# Altium project 8x8.PrjPcb
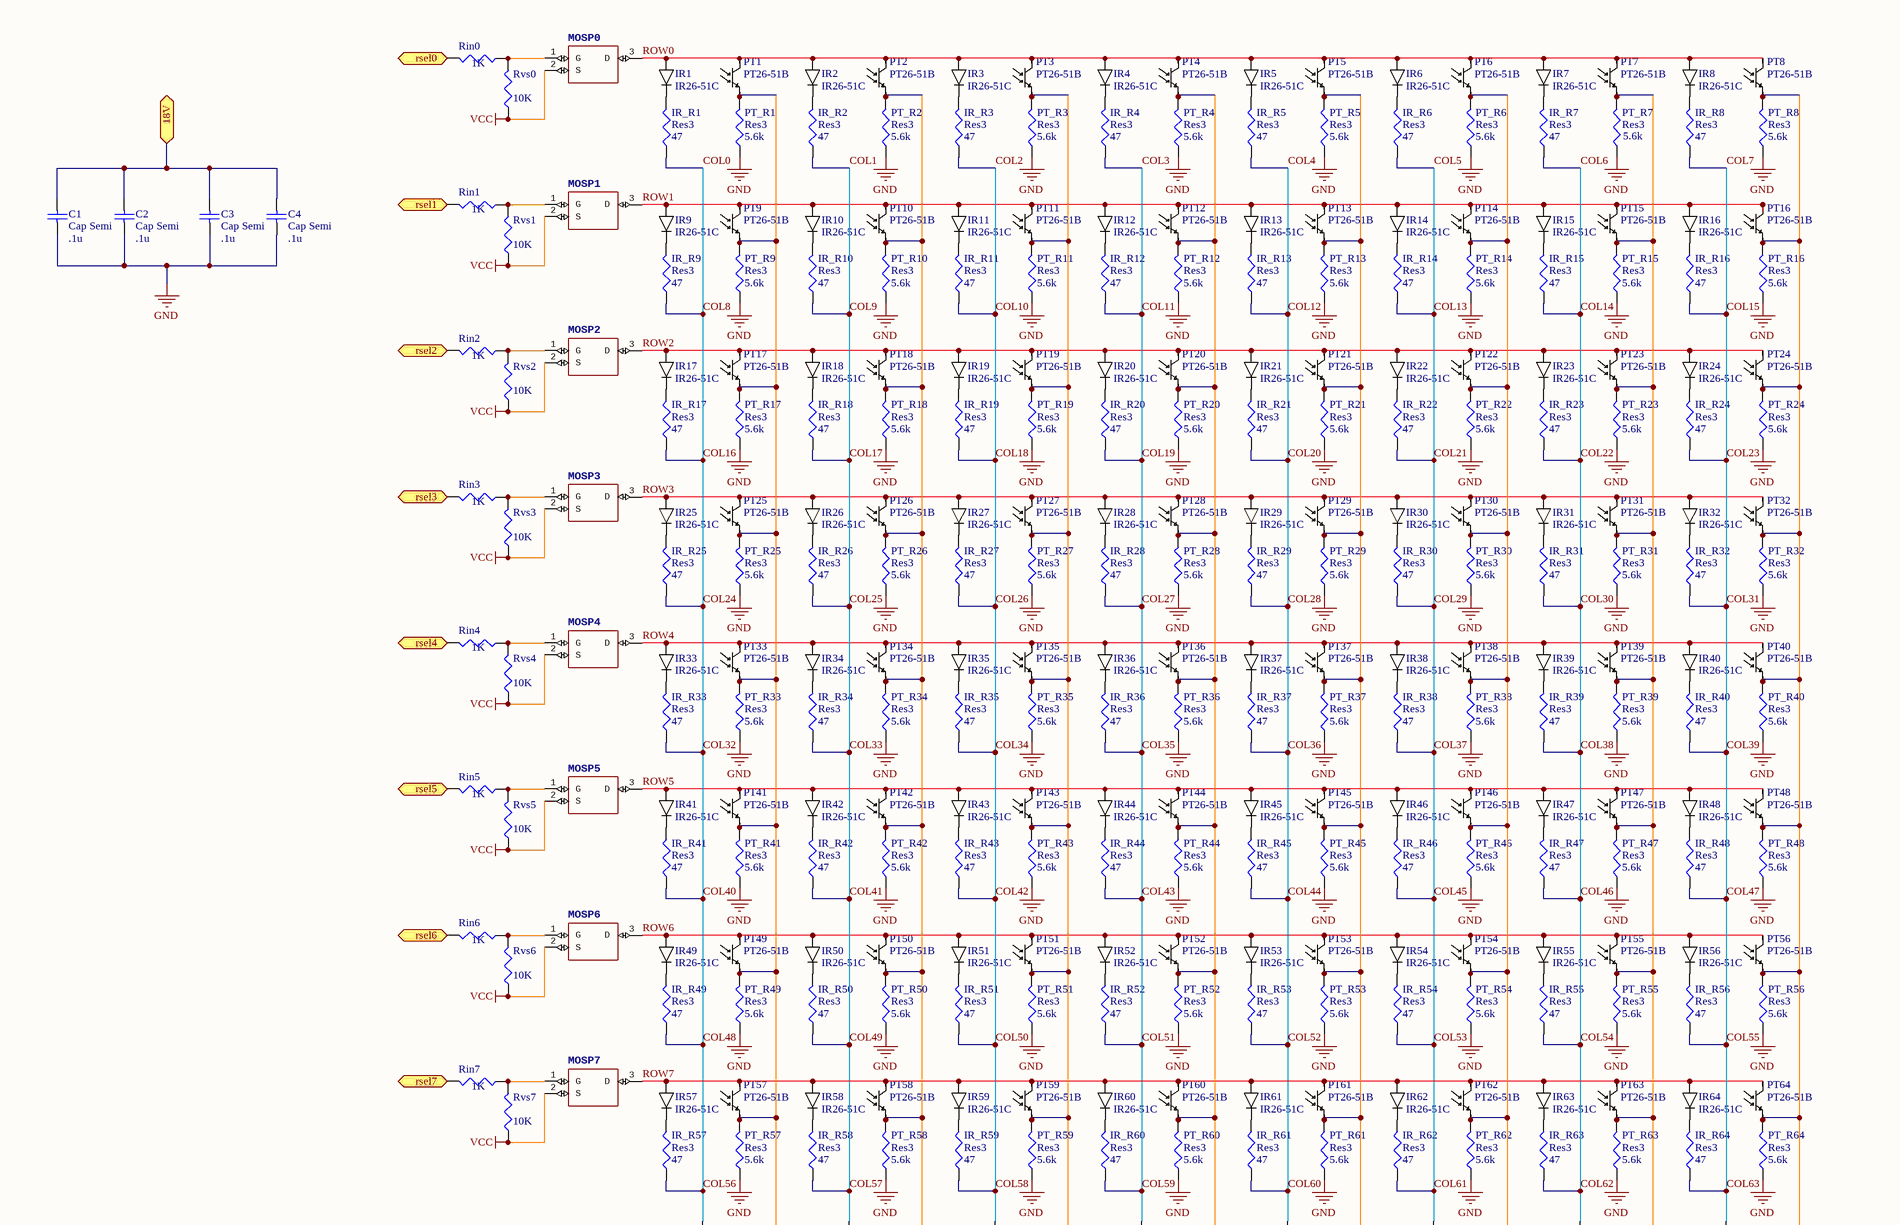
[diagram p0: 8x8v2.SchDoc, top left]
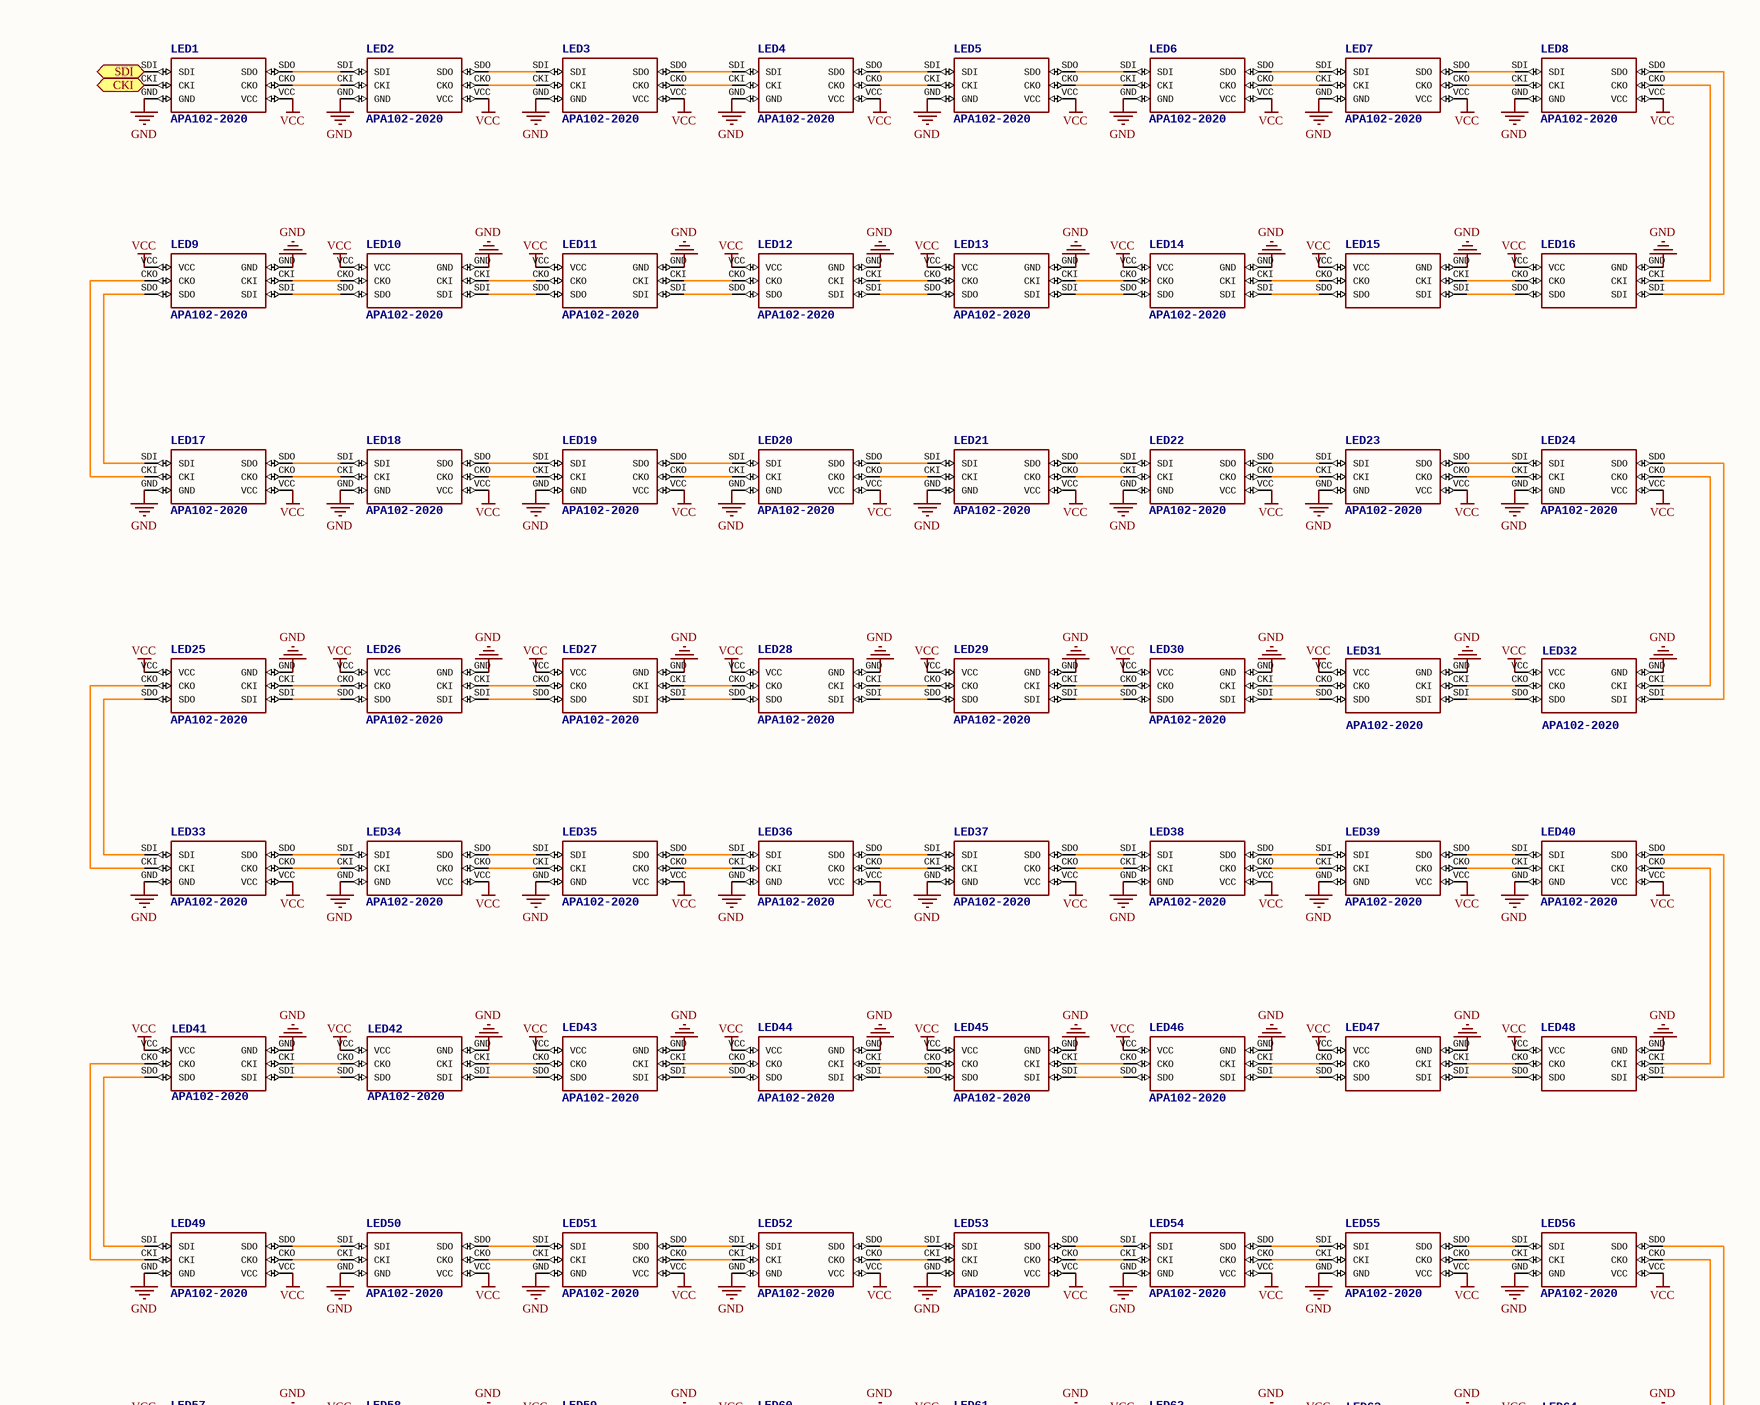
[diagram p1: 8x8v2.SchDoc, top right]
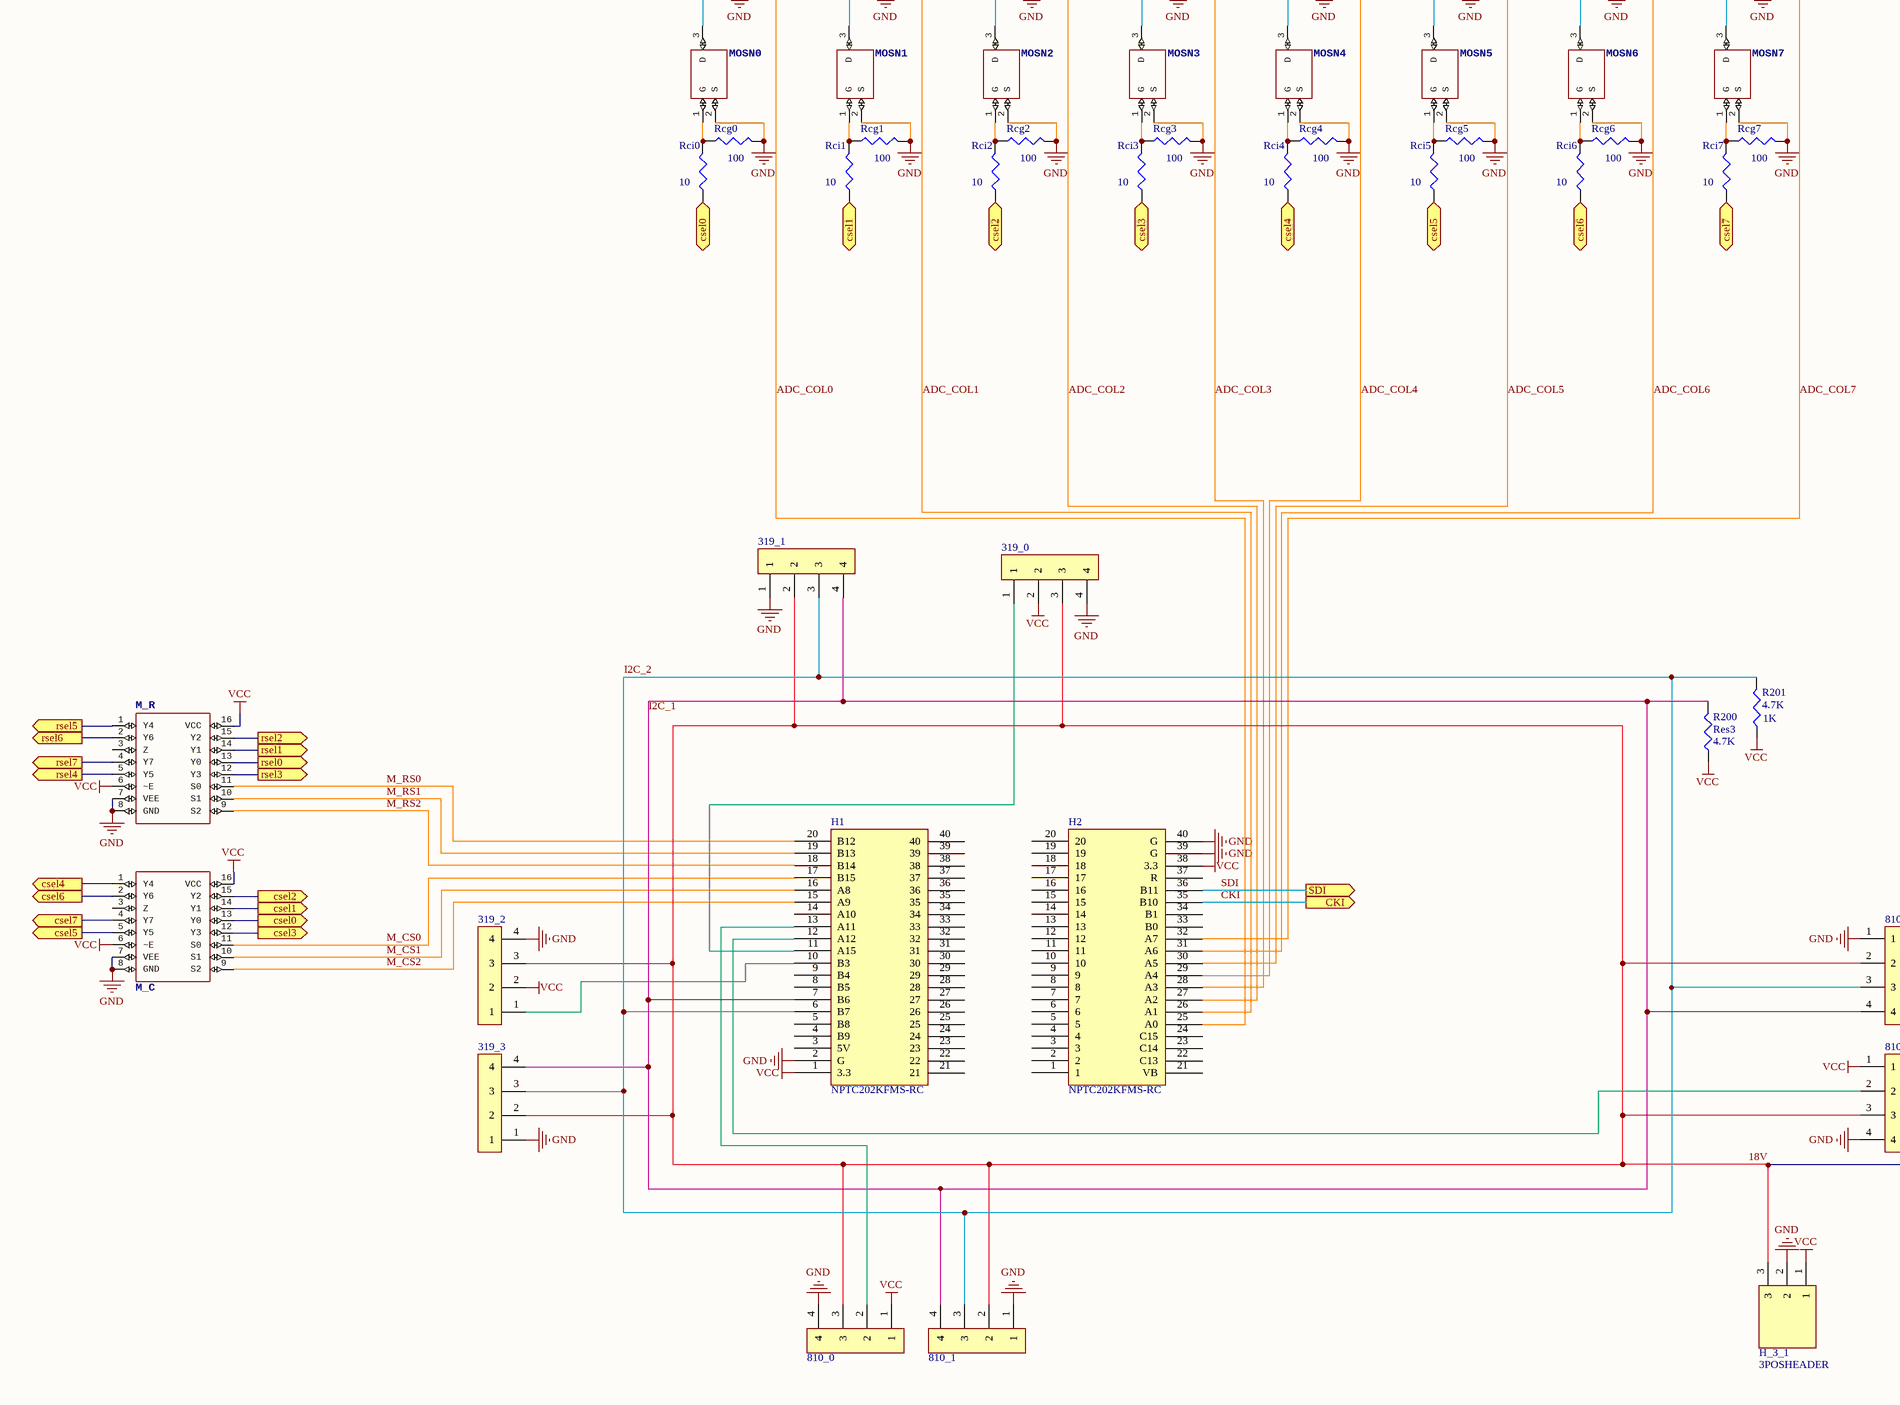
[diagram p2: 8x8v2.SchDoc, bottom left]
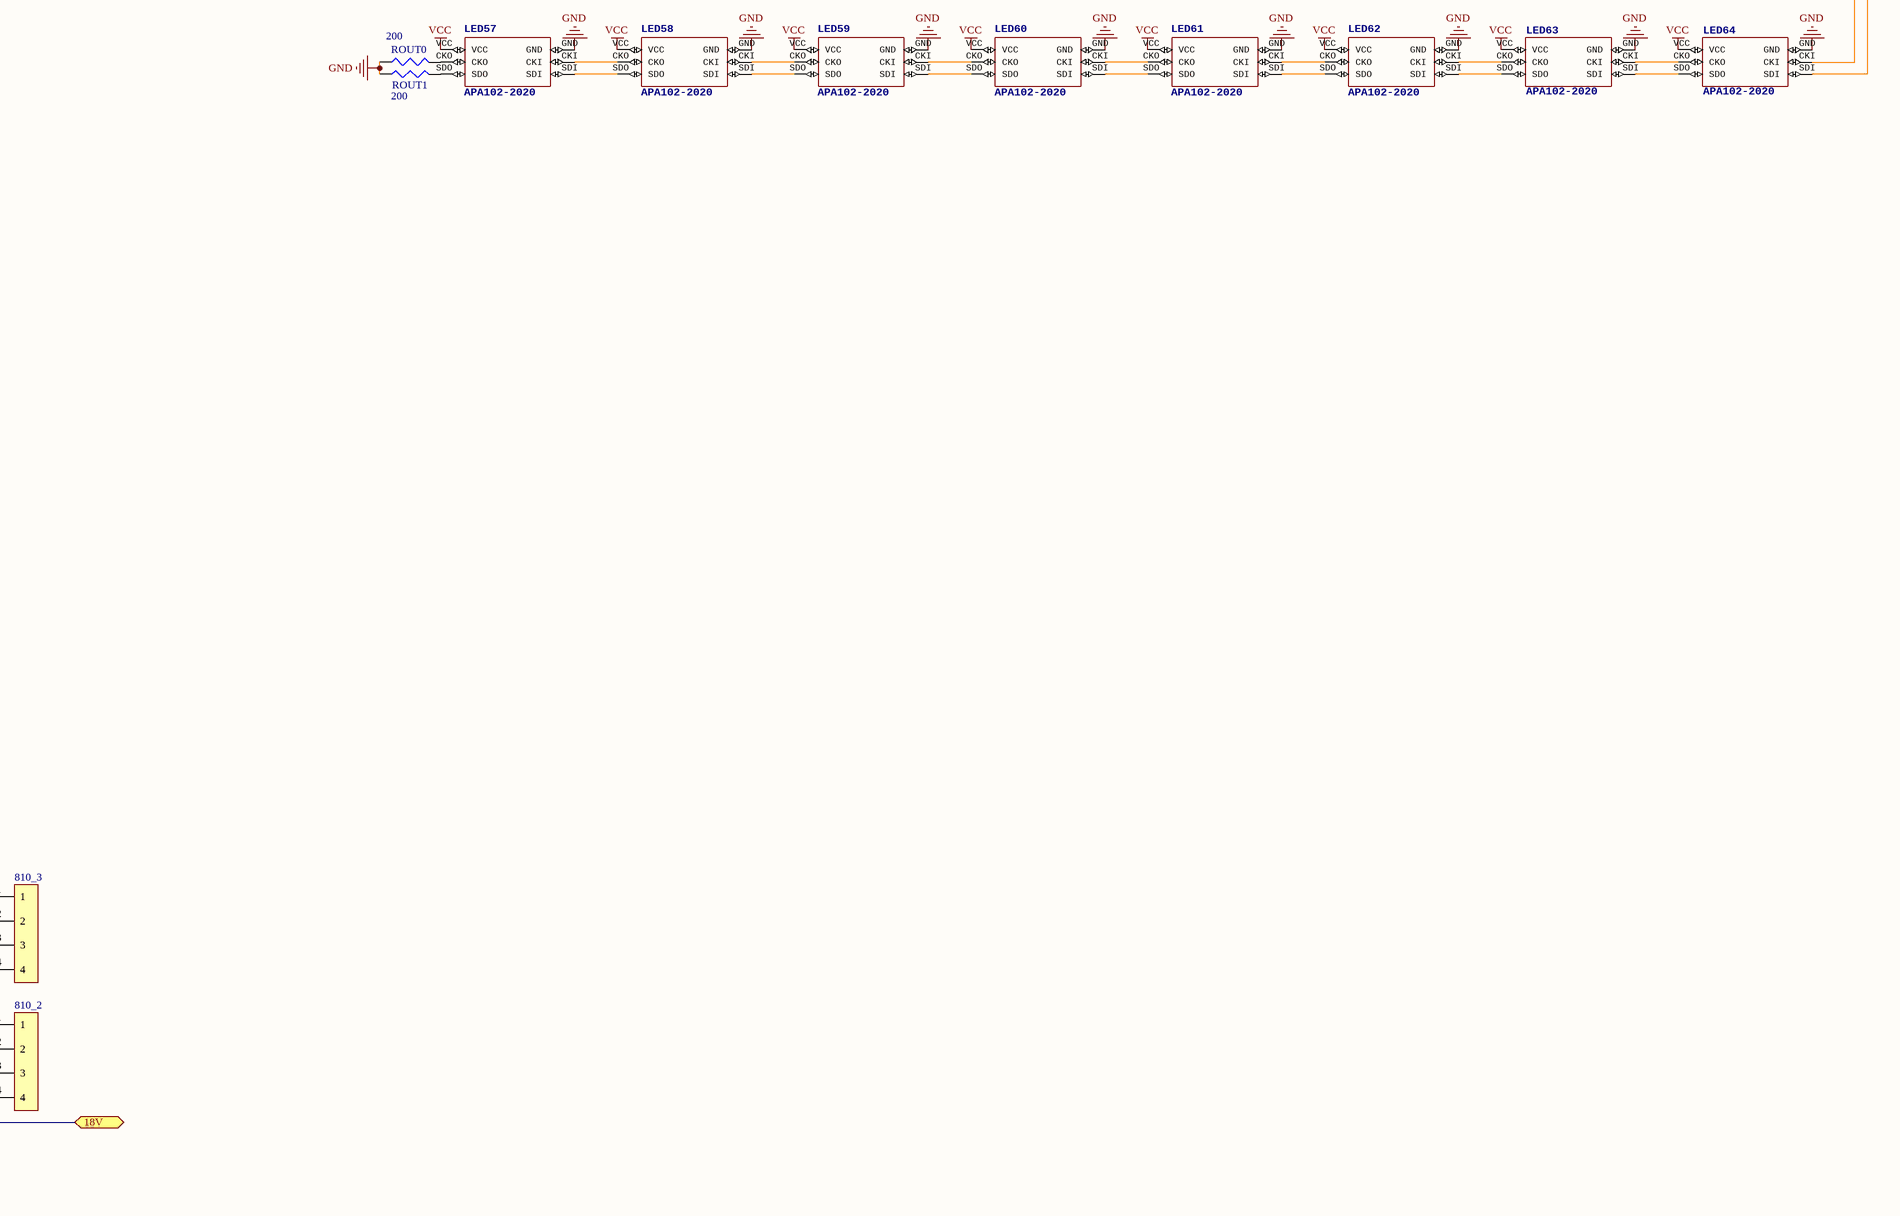
[diagram p3: 8x8v2.SchDoc, bottom right]
1 sheet, 389 parts. Net scope: flat (ports and power ports of the same name join across sheets).
Board file: 8x8v2.PcbDoc

## Sheet 8x8v2.SchDoc
size A1

### Parts
319_0  319_4  [319_4]  (value not drawn)
319_1  319_4  [319_4]  (value not drawn)
319_2  319_4  [319_4]  (value not drawn)
319_3  319_4  [319_4]  (value not drawn)
810_0  810_4  [810_4]  (value not drawn)
810_1  810_4  [810_4]  (value not drawn)
810_2  810_4  [810_4]  (value not drawn)
810_3  810_4  [810_4]  (value not drawn)
C1  Cap Semi  value .1u  [0402]
C2  Cap Semi  value .1u  [0402]
C3  Cap Semi  value .1u  [0402]
C4  Cap Semi  value .1u  [0402]
H1  NPTC202KFMS-RC  [NPTC202KFMS-RC]
H2  NPTC202KFMS-RC  [NPTC202KFMS-RC]
H_3_1  3POSHEADER  [3POSHEADER]
IR1  IR26-51C  [SFH 4056]
IR2  IR26-51C  [SFH 4056]
IR3  IR26-51C  [SFH 4056]
IR4  IR26-51C  [SFH 4056]
IR5  IR26-51C  [SFH 4056]
IR6  IR26-51C  [SFH 4056]
IR7  IR26-51C  [SFH 4056]
IR8  IR26-51C  [SFH 4056]
IR9  IR26-51C  [SFH 4056]
IR10  IR26-51C  [SFH 4056]
IR11  IR26-51C  [SFH 4056]
IR12  IR26-51C  [SFH 4056]
IR13  IR26-51C  [SFH 4056]
IR14  IR26-51C  [SFH 4056]
IR15  IR26-51C  [SFH 4056]
IR16  IR26-51C  [SFH 4056]
IR17  IR26-51C  [SFH 4056]
IR18  IR26-51C  [SFH 4056]
IR19  IR26-51C  [SFH 4056]
IR20  IR26-51C  [SFH 4056]
IR21  IR26-51C  [SFH 4056]
IR22  IR26-51C  [SFH 4056]
IR23  IR26-51C  [SFH 4056]
IR24  IR26-51C  [SFH 4056]
IR25  IR26-51C  [SFH 4056]
IR26  IR26-51C  [SFH 4056]
IR27  IR26-51C  [SFH 4056]
IR28  IR26-51C  [SFH 4056]
IR29  IR26-51C  [SFH 4056]
IR30  IR26-51C  [SFH 4056]
IR31  IR26-51C  [SFH 4056]
IR32  IR26-51C  [SFH 4056]
IR33  IR26-51C  [SFH 4056]
IR34  IR26-51C  [SFH 4056]
IR35  IR26-51C  [SFH 4056]
IR36  IR26-51C  [SFH 4056]
IR37  IR26-51C  [SFH 4056]
IR38  IR26-51C  [SFH 4056]
IR39  IR26-51C  [SFH 4056]
IR40  IR26-51C  [SFH 4056]
IR41  IR26-51C  [SFH 4056]
IR42  IR26-51C  [SFH 4056]
IR43  IR26-51C  [SFH 4056]
IR44  IR26-51C  [SFH 4056]
IR45  IR26-51C  [SFH 4056]
IR46  IR26-51C  [SFH 4056]
IR47  IR26-51C  [SFH 4056]
IR48  IR26-51C  [SFH 4056]
IR49  IR26-51C  [SFH 4056]
IR50  IR26-51C  [SFH 4056]
IR51  IR26-51C  [SFH 4056]
IR52  IR26-51C  [SFH 4056]
IR53  IR26-51C  [SFH 4056]
IR54  IR26-51C  [SFH 4056]
IR55  IR26-51C  [SFH 4056]
IR56  IR26-51C  [SFH 4056]
IR57  IR26-51C  [SFH 4056]
IR58  IR26-51C  [SFH 4056]
IR59  IR26-51C  [SFH 4056]
IR60  IR26-51C  [SFH 4056]
IR61  IR26-51C  [SFH 4056]
IR62  IR26-51C  [SFH 4056]
IR63  IR26-51C  [SFH 4056]
IR64  IR26-51C  [SFH 4056]
IR_R1  Res3  value 47  [J1-0603]
IR_R2  Res3  value 47  [J1-0603]
IR_R3  Res3  value 47  [J1-0603]
IR_R4  Res3  value 47  [J1-0603]
IR_R5  Res3  value 47  [J1-0603]
IR_R6  Res3  value 47  [J1-0603]
IR_R7  Res3  value 47  [J1-0603]
IR_R8  Res3  value 47  [J1-0603]
IR_R9  Res3  value 47  [J1-0603]
IR_R10  Res3  value 47  [J1-0603]
IR_R11  Res3  value 47  [J1-0603]
IR_R12  Res3  value 47  [J1-0603]
IR_R13  Res3  value 47  [J1-0603]
IR_R14  Res3  value 47  [J1-0603]
IR_R15  Res3  value 47  [J1-0603]
IR_R16  Res3  value 47  [J1-0603]
IR_R17  Res3  value 47  [J1-0603]
IR_R18  Res3  value 47  [J1-0603]
IR_R19  Res3  value 47  [J1-0603]
IR_R20  Res3  value 47  [J1-0603]
IR_R21  Res3  value 47  [J1-0603]
IR_R22  Res3  value 47  [J1-0603]
IR_R23  Res3  value 47  [J1-0603]
IR_R24  Res3  value 47  [J1-0603]
IR_R25  Res3  value 47  [J1-0603]
IR_R26  Res3  value 47  [J1-0603]
IR_R27  Res3  value 47  [J1-0603]
IR_R28  Res3  value 47  [J1-0603]
IR_R29  Res3  value 47  [J1-0603]
IR_R30  Res3  value 47  [J1-0603]
IR_R31  Res3  value 47  [J1-0603]
IR_R32  Res3  value 47  [J1-0603]
IR_R33  Res3  value 47  [J1-0603]
IR_R34  Res3  value 47  [J1-0603]
IR_R35  Res3  value 47  [J1-0603]
IR_R36  Res3  value 47  [J1-0603]
IR_R37  Res3  value 47  [J1-0603]
IR_R38  Res3  value 47  [J1-0603]
IR_R39  Res3  value 47  [J1-0603]
IR_R40  Res3  value 47  [J1-0603]
IR_R41  Res3  value 47  [J1-0603]
IR_R42  Res3  value 47  [J1-0603]
IR_R43  Res3  value 47  [J1-0603]
IR_R44  Res3  value 47  [J1-0603]
IR_R45  Res3  value 47  [J1-0603]
IR_R46  Res3  value 47  [J1-0603]
IR_R47  Res3  value 47  [J1-0603]
IR_R48  Res3  value 47  [J1-0603]
IR_R49  Res3  value 47  [J1-0603]
IR_R50  Res3  value 47  [J1-0603]
IR_R51  Res3  value 47  [J1-0603]
IR_R52  Res3  value 47  [J1-0603]
IR_R53  Res3  value 47  [J1-0603]
IR_R54  Res3  value 47  [J1-0603]
IR_R55  Res3  value 47  [J1-0603]
IR_R56  Res3  value 47  [J1-0603]
IR_R57  Res3  value 47  [J1-0603]
IR_R58  Res3  value 47  [J1-0603]
IR_R59  Res3  value 47  [J1-0603]
IR_R60  Res3  value 47  [J1-0603]
IR_R61  Res3  value 47  [J1-0603]
IR_R62  Res3  value 47  [J1-0603]
IR_R63  Res3  value 47  [J1-0603]
IR_R64  Res3  value 47  [J1-0603]
LED1  APA102-2020  [SON75P200X200X100-6N]
LED2  APA102-2020  [SON75P200X200X100-6N]
LED3  APA102-2020  [SON75P200X200X100-6N]
LED4  APA102-2020  [SON75P200X200X100-6N]
LED5  APA102-2020  [SON75P200X200X100-6N]
LED6  APA102-2020  [SON75P200X200X100-6N]
LED7  APA102-2020  [SON75P200X200X100-6N]
LED8  APA102-2020  [SON75P200X200X100-6N]
LED9  APA102-2020  [SON75P200X200X100-6N]
LED10  APA102-2020  [SON75P200X200X100-6N]
LED11  APA102-2020  [SON75P200X200X100-6N]
LED12  APA102-2020  [SON75P200X200X100-6N]
LED13  APA102-2020  [SON75P200X200X100-6N]
LED14  APA102-2020  [SON75P200X200X100-6N]
LED15  APA102-2020  [SON75P200X200X100-6N]  (value not drawn)
LED16  APA102-2020  [SON75P200X200X100-6N]  (value not drawn)
LED17  APA102-2020  [SON75P200X200X100-6N]
LED18  APA102-2020  [SON75P200X200X100-6N]
LED19  APA102-2020  [SON75P200X200X100-6N]
LED20  APA102-2020  [SON75P200X200X100-6N]
LED21  APA102-2020  [SON75P200X200X100-6N]
LED22  APA102-2020  [SON75P200X200X100-6N]
LED23  APA102-2020  [SON75P200X200X100-6N]
LED24  APA102-2020  [SON75P200X200X100-6N]
LED25  APA102-2020  [SON75P200X200X100-6N]
LED26  APA102-2020  [SON75P200X200X100-6N]
LED27  APA102-2020  [SON75P200X200X100-6N]
LED28  APA102-2020  [SON75P200X200X100-6N]
LED29  APA102-2020  [SON75P200X200X100-6N]
LED30  APA102-2020  [SON75P200X200X100-6N]
LED31  APA102-2020  [SON75P200X200X100-6N]
LED32  APA102-2020  [SON75P200X200X100-6N]
LED33  APA102-2020  [SON75P200X200X100-6N]
LED34  APA102-2020  [SON75P200X200X100-6N]
LED35  APA102-2020  [SON75P200X200X100-6N]
LED36  APA102-2020  [SON75P200X200X100-6N]
LED37  APA102-2020  [SON75P200X200X100-6N]
LED38  APA102-2020  [SON75P200X200X100-6N]
LED39  APA102-2020  [SON75P200X200X100-6N]
LED40  APA102-2020  [SON75P200X200X100-6N]
LED41  APA102-2020  [SON75P200X200X100-6N]
LED42  APA102-2020  [SON75P200X200X100-6N]
LED43  APA102-2020  [SON75P200X200X100-6N]
LED44  APA102-2020  [SON75P200X200X100-6N]
LED45  APA102-2020  [SON75P200X200X100-6N]
LED46  APA102-2020  [SON75P200X200X100-6N]
LED47  APA102-2020  [SON75P200X200X100-6N]  (value not drawn)
LED48  APA102-2020  [SON75P200X200X100-6N]  (value not drawn)
LED49  APA102-2020  [SON75P200X200X100-6N]
LED50  APA102-2020  [SON75P200X200X100-6N]
LED51  APA102-2020  [SON75P200X200X100-6N]
LED52  APA102-2020  [SON75P200X200X100-6N]
LED53  APA102-2020  [SON75P200X200X100-6N]
LED54  APA102-2020  [SON75P200X200X100-6N]
LED55  APA102-2020  [SON75P200X200X100-6N]
LED56  APA102-2020  [SON75P200X200X100-6N]
LED57  APA102-2020  [SON75P200X200X100-6N]
LED58  APA102-2020  [SON75P200X200X100-6N]
LED59  APA102-2020  [SON75P200X200X100-6N]
LED60  APA102-2020  [SON75P200X200X100-6N]
LED61  APA102-2020  [SON75P200X200X100-6N]
LED62  APA102-2020  [SON75P200X200X100-6N]
LED63  APA102-2020  [SON75P200X200X100-6N]
LED64  APA102-2020  [SON75P200X200X100-6N]
M_C  8-channel analog multiplexer/demultiplexer   Source:  Datasheet  [SOP65P640X110-16N]  (value not drawn)
M_R  8-channel analog multiplexer/demultiplexer   Source:  Datasheet  [SOP65P640X110-16N]  (value not drawn)
MOSN0  MOSFET 12V N-Ch Enh FET 2426pF 27.3nC   Source:  Datasheet  [SOT95P285X130-3N]  (value not drawn)
MOSN1  MOSFET 12V N-Ch Enh FET 2426pF 27.3nC   Source:  Datasheet  [SOT95P285X130-3N]  (value not drawn)
MOSN2  MOSFET 12V N-Ch Enh FET 2426pF 27.3nC   Source:  Datasheet  [SOT95P285X130-3N]  (value not drawn)
MOSN3  MOSFET 12V N-Ch Enh FET 2426pF 27.3nC   Source:  Datasheet  [SOT95P285X130-3N]  (value not drawn)
MOSN4  MOSFET 12V N-Ch Enh FET 2426pF 27.3nC   Source:  Datasheet  [SOT95P285X130-3N]  (value not drawn)
MOSN5  MOSFET 12V N-Ch Enh FET 2426pF 27.3nC   Source:  Datasheet  [SOT95P285X130-3N]  (value not drawn)
MOSN6  MOSFET 12V N-Ch Enh FET 2426pF 27.3nC   Source:  Datasheet  [SOT95P285X130-3N]  (value not drawn)
MOSN7  MOSFET 12V N-Ch Enh FET 2426pF 27.3nC   Source:  Datasheet  [SOT95P285X130-3N]  (value not drawn)
MOSP0  Power MOSFET   Source:  Datasheet  [SOT65P220X100-3N]  (value not drawn)
MOSP1  Power MOSFET   Source:  Datasheet  [SOT65P220X100-3N]  (value not drawn)
MOSP2  Power MOSFET   Source:  Datasheet  [SOT65P220X100-3N]  (value not drawn)
MOSP3  Power MOSFET   Source:  Datasheet  [SOT65P220X100-3N]  (value not drawn)
MOSP4  Power MOSFET   Source:  Datasheet  [SOT65P220X100-3N]  (value not drawn)
MOSP5  Power MOSFET   Source:  Datasheet  [SOT65P220X100-3N]  (value not drawn)
MOSP6  Power MOSFET   Source:  Datasheet  [SOT65P220X100-3N]  (value not drawn)
MOSP7  Power MOSFET   Source:  Datasheet  [SOT65P220X100-3N]  (value not drawn)
PT1  PT26-51B  [VEMT2020X01]
PT2  PT26-51B  [VEMT2020X01]
PT3  PT26-51B  [VEMT2020X01]
PT4  PT26-51B  [VEMT2020X01]
PT5  PT26-51B  [VEMT2020X01]
PT6  PT26-51B  [VEMT2020X01]
PT7  PT26-51B  [VEMT2020X01]
PT8  PT26-51B  [VEMT2020X01]
PT9  PT26-51B  [VEMT2020X01]
PT10  PT26-51B  [VEMT2020X01]
PT11  PT26-51B  [VEMT2020X01]
PT12  PT26-51B  [VEMT2020X01]
PT13  PT26-51B  [VEMT2020X01]
PT14  PT26-51B  [VEMT2020X01]
PT15  PT26-51B  [VEMT2020X01]
PT16  PT26-51B  [VEMT2020X01]
PT17  PT26-51B  [VEMT2020X01]
PT18  PT26-51B  [VEMT2020X01]
PT19  PT26-51B  [VEMT2020X01]
PT20  PT26-51B  [VEMT2020X01]
PT21  PT26-51B  [VEMT2020X01]
PT22  PT26-51B  [VEMT2020X01]
PT23  PT26-51B  [VEMT2020X01]
PT24  PT26-51B  [VEMT2020X01]
PT25  PT26-51B  [VEMT2020X01]
PT26  PT26-51B  [VEMT2020X01]
PT27  PT26-51B  [VEMT2020X01]
PT28  PT26-51B  [VEMT2020X01]
PT29  PT26-51B  [VEMT2020X01]
PT30  PT26-51B  [VEMT2020X01]
PT31  PT26-51B  [VEMT2020X01]
PT32  PT26-51B  [VEMT2020X01]
PT33  PT26-51B  [VEMT2020X01]
PT34  PT26-51B  [VEMT2020X01]
PT35  PT26-51B  [VEMT2020X01]
PT36  PT26-51B  [VEMT2020X01]
PT37  PT26-51B  [VEMT2020X01]
PT38  PT26-51B  [VEMT2020X01]
PT39  PT26-51B  [VEMT2020X01]
PT40  PT26-51B  [VEMT2020X01]
PT41  PT26-51B  [VEMT2020X01]
PT42  PT26-51B  [VEMT2020X01]
PT43  PT26-51B  [VEMT2020X01]
PT44  PT26-51B  [VEMT2020X01]
PT45  PT26-51B  [VEMT2020X01]
PT46  PT26-51B  [VEMT2020X01]
PT47  PT26-51B  [VEMT2020X01]
PT48  PT26-51B  [VEMT2020X01]
PT49  PT26-51B  [VEMT2020X01]
PT50  PT26-51B  [VEMT2020X01]
PT51  PT26-51B  [VEMT2020X01]
PT52  PT26-51B  [VEMT2020X01]
PT53  PT26-51B  [VEMT2020X01]
PT54  PT26-51B  [VEMT2020X01]
PT55  PT26-51B  [VEMT2020X01]
PT56  PT26-51B  [VEMT2020X01]
PT57  PT26-51B  [VEMT2020X01]
PT58  PT26-51B  [VEMT2020X01]
PT59  PT26-51B  [VEMT2020X01]
PT60  PT26-51B  [VEMT2020X01]
PT61  PT26-51B  [VEMT2020X01]
PT62  PT26-51B  [VEMT2020X01]
PT63  PT26-51B  [VEMT2020X01]
PT64  PT26-51B  [VEMT2020X01]
PT_R1  Res3  value 5.6k  [J1-0603]
PT_R2  Res3  value 5.6k  [J1-0603]
PT_R3  Res3  value 5.6k  [J1-0603]
PT_R4  Res3  value 5.6k  [J1-0603]
PT_R5  Res3  value 5.6k  [J1-0603]
PT_R6  Res3  value 5.6k  [J1-0603]
PT_R7  Res3  value 5.6k  [J1-0603]
PT_R8  Res3  value 5.6k  [J1-0603]
PT_R9  Res3  value 5.6k  [J1-0603]
PT_R10  Res3  value 5.6k  [J1-0603]
PT_R11  Res3  value 5.6k  [J1-0603]
PT_R12  Res3  value 5.6k  [J1-0603]
PT_R13  Res3  value 5.6k  [J1-0603]
PT_R14  Res3  value 5.6k  [J1-0603]
PT_R15  Res3  value 5.6k  [J1-0603]
PT_R16  Res3  value 5.6k  [J1-0603]
PT_R17  Res3  value 5.6k  [J1-0603]
PT_R18  Res3  value 5.6k  [J1-0603]
PT_R19  Res3  value 5.6k  [J1-0603]
PT_R20  Res3  value 5.6k  [J1-0603]
PT_R21  Res3  value 5.6k  [J1-0603]
PT_R22  Res3  value 5.6k  [J1-0603]
PT_R23  Res3  value 5.6k  [J1-0603]
PT_R24  Res3  value 5.6k  [J1-0603]
PT_R25  Res3  value 5.6k  [J1-0603]
PT_R26  Res3  value 5.6k  [J1-0603]
PT_R27  Res3  value 5.6k  [J1-0603]
PT_R28  Res3  value 5.6k  [J1-0603]
PT_R29  Res3  value 5.6k  [J1-0603]
PT_R30  Res3  value 5.6k  [J1-0603]
PT_R31  Res3  value 5.6k  [J1-0603]
PT_R32  Res3  value 5.6k  [J1-0603]
PT_R33  Res3  value 5.6k  [J1-0603]
PT_R34  Res3  value 5.6k  [J1-0603]
PT_R35  Res3  value 5.6k  [J1-0603]
PT_R36  Res3  value 5.6k  [J1-0603]
PT_R37  Res3  value 5.6k  [J1-0603]
PT_R38  Res3  value 5.6k  [J1-0603]
PT_R39  Res3  value 5.6k  [J1-0603]
PT_R40  Res3  value 5.6k  [J1-0603]
PT_R41  Res3  value 5.6k  [J1-0603]
PT_R42  Res3  value 5.6k  [J1-0603]
PT_R43  Res3  value 5.6k  [J1-0603]
PT_R44  Res3  value 5.6k  [J1-0603]
PT_R45  Res3  value 5.6k  [J1-0603]
PT_R46  Res3  value 5.6k  [J1-0603]
PT_R47  Res3  value 5.6k  [J1-0603]
PT_R48  Res3  value 5.6k  [J1-0603]
PT_R49  Res3  value 5.6k  [J1-0603]
PT_R50  Res3  value 5.6k  [J1-0603]
PT_R51  Res3  value 5.6k  [J1-0603]
PT_R52  Res3  value 5.6k  [J1-0603]
PT_R53  Res3  value 5.6k  [J1-0603]
PT_R54  Res3  value 5.6k  [J1-0603]
PT_R55  Res3  value 5.6k  [J1-0603]
PT_R56  Res3  value 5.6k  [J1-0603]
PT_R57  Res3  value 5.6k  [J1-0603]
PT_R58  Res3  value 5.6k  [J1-0603]
PT_R59  Res3  value 5.6k  [J1-0603]
PT_R60  Res3  value 5.6k  [J1-0603]
PT_R61  Res3  value 5.6k  [J1-0603]
PT_R62  Res3  value 5.6k  [J1-0603]
PT_R63  Res3  value 5.6k  [J1-0603]
PT_R64  Res3  value 5.6k  [J1-0603]
R200  Res3  value 4.7K  [J1-0603]
R201  4.7K  value 1K  [J1-0603]
Rcg0  value 100  [J1-0603]  (hidden comment: Res3)
Rcg1  value 100  [J1-0603]  (hidden comment: Res3)
Rcg2  value 100  [J1-0603]  (hidden comment: Res3)
Rcg3  value 100  [J1-0603]  (hidden comment: Res3)
Rcg4  value 100  [J1-0603]  (hidden comment: Res3)
Rcg5  value 100  [J1-0603]  (hidden comment: Res3)
Rcg6  value 100  [J1-0603]  (hidden comment: Res3)
Rcg7  value 100  [J1-0603]  (hidden comment: Res3)
Rci0  value 10  [J1-0603]  (hidden comment: Res3)
Rci1  value 10  [J1-0603]  (hidden comment: Res3)
Rci2  value 10  [J1-0603]  (hidden comment: Res3)
Rci3  value 10  [J1-0603]  (hidden comment: Res3)
Rci4  value 10  [J1-0603]  (hidden comment: Res3)
Rci5  value 10  [J1-0603]  (hidden comment: Res3)
Rci6  value 10  [J1-0603]  (hidden comment: Res3)
Rci7  value 10  [J1-0603]  (hidden comment: Res3)
Rin0  value 1K  [J1-0603]  (hidden comment: Res3)
Rin1  value 1K  [J1-0603]  (hidden comment: Res3)
Rin2  value 1K  [J1-0603]  (hidden comment: Res3)
Rin3  value 1K  [J1-0603]  (hidden comment: Res3)
Rin4  value 1K  [J1-0603]  (hidden comment: Res3)
Rin5  value 1K  [J1-0603]  (hidden comment: Res3)
Rin6  value 1K  [J1-0603]  (hidden comment: Res3)
Rin7  value 1K  [J1-0603]  (hidden comment: Res3)
ROUT0  value 200  [J1-0603]  (hidden comment: Res3)
ROUT1  value 200  [J1-0603]  (hidden comment: Res3)
Rvs0  value 10K  [J1-0603]  (hidden comment: Res3)
Rvs1  value 10K  [J1-0603]  (hidden comment: Res3)
Rvs2  value 10K  [J1-0603]  (hidden comment: Res3)
Rvs3  value 10K  [J1-0603]  (hidden comment: Res3)
Rvs4  value 10K  [J1-0603]  (hidden comment: Res3)
Rvs5  value 10K  [J1-0603]  (hidden comment: Res3)
Rvs6  value 10K  [J1-0603]  (hidden comment: Res3)
Rvs7  value 10K  [J1-0603]  (hidden comment: Res3)

### Ports
18V (bidir), CKI (in), CKI (out), csel0 (in), csel0 (out), csel1 (in), csel1 (out), csel2 (in), csel2 (out), csel3 (in), csel3 (out), csel4 (in), csel4 (out), csel5 (in), csel5 (out), csel6 (in), csel6 (out), csel7 (in), csel7 (out), rsel0 (in), rsel0 (out), rsel1 (in), rsel1 (out), rsel2 (in), rsel2 (out), rsel3 (in), rsel3 (out), rsel4 (in), rsel4 (out), rsel5 (in), rsel5 (out), rsel6 (in), rsel6 (out), rsel7 (in), rsel7 (out), SDI (in), SDI (out)

### Nets
GND: 319_0.4 319_1.1 319_2.4 319_3.1 810_0.4 810_1.1 810_2.4 810_3.1 C1.1 C2.1 C3.1 C4.1 H1.2(G) H2.39(G) H2.40(G) H_3_1.2 LED1.GND LED2.GND LED3.GND LED4.GND LED5.GND LED6.GND LED7.GND LED8.GND LED9.GND LED10.GND LED11.GND LED12.GND LED13.GND LED14.GND LED15.GND LED16.GND LED17.GND LED18.GND LED19.GND LED20.GND LED21.GND LED22.GND LED23.GND LED24.GND LED25.GND LED26.GND LED27.GND LED28.GND LED29.GND LED30.GND LED31.GND LED32.GND LED33.GND LED34.GND LED35.GND LED36.GND LED37.GND LED38.GND LED39.GND LED40.GND LED41.GND LED42.GND LED43.GND LED44.GND LED45.GND LED46.GND LED47.GND LED48.GND LED49.GND LED50.GND LED51.GND LED52.GND LED53.GND LED54.GND LED55.GND LED56.GND LED57.GND LED58.GND LED59.GND LED60.GND LED61.GND LED62.GND LED63.GND LED64.GND M_C.7(VEE) M_C.8(GND) M_R.7(VEE) M_R.8(GND) MOSN0.2(S) MOSN1.2(S) MOSN2.2(S) MOSN3.2(S) MOSN4.2(S) MOSN5.2(S) MOSN6.2(S) MOSN7.2(S) PT_R1.1 PT_R2.1 PT_R3.1 PT_R4.1 PT_R5.1 PT_R6.1 PT_R7.1 PT_R8.1 PT_R9.1 PT_R10.1 PT_R11.1 PT_R12.1 PT_R13.1 PT_R14.1 PT_R15.1 PT_R16.1 PT_R17.1 PT_R18.1 PT_R19.1 PT_R20.1 PT_R21.1 PT_R22.1 PT_R23.1 PT_R24.1 PT_R25.1 PT_R26.1 PT_R27.1 PT_R28.1 PT_R29.1 PT_R30.1 PT_R31.1 PT_R32.1 PT_R33.1 PT_R34.1 PT_R35.1 PT_R36.1 PT_R37.1 PT_R38.1 PT_R39.1 PT_R40.1 PT_R41.1 PT_R42.1 PT_R43.1 PT_R44.1 PT_R45.1 PT_R46.1 PT_R47.1 PT_R48.1 PT_R49.1 PT_R50.1 PT_R51.1 PT_R52.1 PT_R53.1 PT_R54.1 PT_R55.1 PT_R56.1 PT_R57.1 PT_R58.1 PT_R59.1 PT_R60.1 PT_R61.1 PT_R62.1 PT_R63.1 PT_R64.1 Rcg0.2 Rcg1.2 Rcg2.2 Rcg3.2 Rcg4.2 Rcg5.2 Rcg6.2 Rcg7.2 ROUT0.1 ROUT1.1
VCC: 319_0.2 319_2.2 810_0.1 810_2.1 H1.1(3.3) H2.38(3.3) H_3_1.1 LED1.VCC LED2.VCC LED3.VCC LED4.VCC LED5.VCC LED6.VCC LED7.VCC LED8.VCC LED9.VCC LED10.VCC LED11.VCC LED12.VCC LED13.VCC LED14.VCC LED15.VCC LED16.VCC LED17.VCC LED18.VCC LED19.VCC LED20.VCC LED21.VCC LED22.VCC LED23.VCC LED24.VCC LED25.VCC LED26.VCC LED27.VCC LED28.VCC LED29.VCC LED30.VCC LED31.VCC LED32.VCC LED33.VCC LED34.VCC LED35.VCC LED36.VCC LED37.VCC LED38.VCC LED39.VCC LED40.VCC LED41.VCC LED42.VCC LED43.VCC LED44.VCC LED45.VCC LED46.VCC LED47.VCC LED48.VCC LED49.VCC LED50.VCC LED51.VCC LED52.VCC LED53.VCC LED54.VCC LED55.VCC LED56.VCC LED57.VCC LED58.VCC LED59.VCC LED60.VCC LED61.VCC LED62.VCC LED63.VCC LED64.VCC M_C.6(~E) M_C.16(VCC) M_R.6(~E) M_R.16(VCC) MOSP0.2(S) MOSP1.2(S) MOSP2.2(S) MOSP3.2(S) MOSP4.2(S) MOSP5.2(S) MOSP6.2(S) MOSP7.2(S) R200.1 R201.1 Rvs0.1 Rvs1.1 Rvs2.1 Rvs3.1 Rvs4.1 Rvs5.1 Rvs6.1 Rvs7.1
18V: 319_0.3 319_1.2 319_2.3 319_3.2 810_0.3 810_1.2 810_2.3 810_3.2 C1.2 C2.2 C3.2 C4.2 H_3_1.3 ; port 18V
ADC_COL0: H2.25(A0) PT1.2(E) PT9.2(E) PT17.2(E) PT25.2(E) PT33.2(E) PT41.2(E) PT49.2(E) PT57.2(E) PT_R1.2 PT_R9.2 PT_R17.2 PT_R25.2 PT_R33.2 PT_R41.2 PT_R49.2 PT_R57.2
ADC_COL1: H2.26(A1) PT2.2(E) PT10.2(E) PT18.2(E) PT26.2(E) PT34.2(E) PT42.2(E) PT50.2(E) PT58.2(E) PT_R2.2 PT_R10.2 PT_R18.2 PT_R26.2 PT_R34.2 PT_R42.2 PT_R50.2 PT_R58.2
ADC_COL2: H2.27(A2) PT3.2(E) PT11.2(E) PT19.2(E) PT27.2(E) PT35.2(E) PT43.2(E) PT51.2(E) PT59.2(E) PT_R3.2 PT_R11.2 PT_R19.2 PT_R27.2 PT_R35.2 PT_R43.2 PT_R51.2 PT_R59.2
ADC_COL3: H2.28(A3) PT4.2(E) PT12.2(E) PT20.2(E) PT28.2(E) PT36.2(E) PT44.2(E) PT52.2(E) PT60.2(E) PT_R4.2 PT_R12.2 PT_R20.2 PT_R28.2 PT_R36.2 PT_R44.2 PT_R52.2 PT_R60.2
ADC_COL4: H2.29(A4) PT5.2(E) PT13.2(E) PT21.2(E) PT29.2(E) PT37.2(E) PT45.2(E) PT53.2(E) PT61.2(E) PT_R5.2 PT_R13.2 PT_R21.2 PT_R29.2 PT_R37.2 PT_R45.2 PT_R53.2 PT_R61.2
ADC_COL5: H2.30(A5) PT6.2(E) PT14.2(E) PT22.2(E) PT30.2(E) PT38.2(E) PT46.2(E) PT54.2(E) PT62.2(E) PT_R6.2 PT_R14.2 PT_R22.2 PT_R30.2 PT_R38.2 PT_R46.2 PT_R54.2 PT_R62.2
ADC_COL6: H2.31(A6) PT7.2(E) PT15.2(E) PT23.2(E) PT31.2(E) PT39.2(E) PT47.2(E) PT55.2(E) PT63.2(E) PT_R7.2 PT_R15.2 PT_R23.2 PT_R31.2 PT_R39.2 PT_R47.2 PT_R55.2 PT_R63.2
ADC_COL7: H2.32(A7) PT8.2(E) PT16.2(E) PT24.2(E) PT32.2(E) PT40.2(E) PT48.2(E) PT56.2(E) PT64.2(E) PT_R8.2 PT_R16.2 PT_R24.2 PT_R32.2 PT_R40.2 PT_R48.2 PT_R56.2 PT_R64.2
CKI: H2.35(B10) LED1.CKI ; port CKI
COL0: IR_R1.1 IR_R9.1 IR_R17.1 IR_R25.1 IR_R33.1 IR_R41.1 IR_R49.1 IR_R57.1 MOSN0.3(D)  [also labelled COL16, COL24, COL32, COL40, COL48, COL56, COL8]
COL1: IR_R2.1 IR_R10.1 IR_R18.1 IR_R26.1 IR_R34.1 IR_R42.1 IR_R50.1 IR_R58.1 MOSN1.3(D)  [also labelled COL17, COL25, COL33, COL41, COL49, COL57, COL9]
COL10: IR_R3.1 IR_R11.1 IR_R19.1 IR_R27.1 IR_R35.1 IR_R43.1 IR_R51.1 IR_R59.1 MOSN2.3(D)  [also labelled COL18, COL2, COL26, COL34, COL42, COL50, COL58]
COL11: IR_R4.1 IR_R12.1 IR_R20.1 IR_R28.1 IR_R36.1 IR_R44.1 IR_R52.1 IR_R60.1 MOSN3.3(D)  [also labelled COL19, COL27, COL3, COL35, COL43, COL51, COL59]
COL12: IR_R5.1 IR_R13.1 IR_R21.1 IR_R29.1 IR_R37.1 IR_R45.1 IR_R53.1 IR_R61.1 MOSN4.3(D)  [also labelled COL20, COL28, COL36, COL4, COL44, COL52, COL60]
COL13: IR_R6.1 IR_R14.1 IR_R22.1 IR_R30.1 IR_R38.1 IR_R46.1 IR_R54.1 IR_R62.1 MOSN5.3(D)  [also labelled COL21, COL29, COL37, COL45, COL5, COL53, COL61]
COL14: IR_R7.1 IR_R15.1 IR_R23.1 IR_R31.1 IR_R39.1 IR_R47.1 IR_R55.1 IR_R63.1 MOSN6.3(D)  [also labelled COL22, COL30, COL38, COL46, COL54, COL6, COL62]
COL15: IR_R8.1 IR_R16.1 IR_R24.1 IR_R32.1 IR_R40.1 IR_R48.1 IR_R56.1 IR_R64.1 MOSN7.3(D)  [also labelled COL23, COL31, COL39, COL47, COL55, COL63, COL7]
I2C_1: 319_1.4 319_3.4 810_1.4 810_3.4 H1.7(B6) R200.2
I2C_2: 319_1.3 319_3.3 810_1.3 810_3.3 H1.6(B7) R201.2
M_CS0: H1.17(B15) M_C.11(S0)
M_CS1: H1.16(A8) M_C.10(S1)
M_CS2: H1.15(A9) M_C.9(S2)
M_RS0: H1.20(B12) M_R.11(S0)
M_RS1: H1.19(B13) M_R.10(S1)
M_RS2: H1.18(B14) M_R.9(S2)
ROW0: IR1.1(A) IR2.1(A) IR3.1(A) IR4.1(A) IR5.1(A) IR6.1(A) IR7.1(A) IR8.1(A) MOSP0.3(D) PT1.1(C) PT2.1(C) PT3.1(C) PT4.1(C) PT5.1(C) PT6.1(C) PT7.1(C) PT8.1(C)
ROW1: IR9.1(A) IR10.1(A) IR11.1(A) IR12.1(A) IR13.1(A) IR14.1(A) IR15.1(A) IR16.1(A) MOSP1.3(D) PT9.1(C) PT10.1(C) PT11.1(C) PT12.1(C) PT13.1(C) PT14.1(C) PT15.1(C) PT16.1(C)
ROW2: IR17.1(A) IR18.1(A) IR19.1(A) IR20.1(A) IR21.1(A) IR22.1(A) IR23.1(A) IR24.1(A) MOSP2.3(D) PT17.1(C) PT18.1(C) PT19.1(C) PT20.1(C) PT21.1(C) PT22.1(C) PT23.1(C) PT24.1(C)
ROW3: IR25.1(A) IR26.1(A) IR27.1(A) IR28.1(A) IR29.1(A) IR30.1(A) IR31.1(A) IR32.1(A) MOSP3.3(D) PT25.1(C) PT26.1(C) PT27.1(C) PT28.1(C) PT29.1(C) PT30.1(C) PT31.1(C) PT32.1(C)
ROW4: IR33.1(A) IR34.1(A) IR35.1(A) IR36.1(A) IR37.1(A) IR38.1(A) IR39.1(A) IR40.1(A) MOSP4.3(D) PT33.1(C) PT34.1(C) PT35.1(C) PT36.1(C) PT37.1(C) PT38.1(C) PT39.1(C) PT40.1(C)
ROW5: IR41.1(A) IR42.1(A) IR43.1(A) IR44.1(A) IR45.1(A) IR46.1(A) IR47.1(A) IR48.1(A) MOSP5.3(D) PT41.1(C) PT42.1(C) PT43.1(C) PT44.1(C) PT45.1(C) PT46.1(C) PT47.1(C) PT48.1(C)
ROW6: IR49.1(A) IR50.1(A) IR51.1(A) IR52.1(A) IR53.1(A) IR54.1(A) IR55.1(A) IR56.1(A) MOSP6.3(D) PT49.1(C) PT50.1(C) PT51.1(C) PT52.1(C) PT53.1(C) PT54.1(C) PT55.1(C) PT56.1(C)
ROW7: IR57.1(A) IR58.1(A) IR59.1(A) IR60.1(A) IR61.1(A) IR62.1(A) IR63.1(A) IR64.1(A) MOSP7.3(D) PT57.1(C) PT58.1(C) PT59.1(C) PT60.1(C) PT61.1(C) PT62.1(C) PT63.1(C) PT64.1(C)
SDI: H2.36(B11) LED1.SDI ; port SDI
Net319_0_1: 319_0.1 H1.11(A15)
Net319_2_1: 319_2.1 H1.10(B3)
Net810_0_2: 810_0.2 H1.13(A11)
Net810_2_2: 810_2.2 H1.12(A12)
NetIR1_2: IR1.2(C) IR_R1.2
NetIR2_2: IR2.2(C) IR_R2.2
NetIR3_2: IR3.2(C) IR_R3.2
NetIR4_2: IR4.2(C) IR_R4.2
NetIR5_2: IR5.2(C) IR_R5.2
NetIR6_2: IR6.2(C) IR_R6.2
NetIR7_2: IR7.2(C) IR_R7.2
NetIR8_2: IR8.2(C) IR_R8.2
NetIR9_2: IR9.2(C) IR_R9.2
NetIR10_2: IR10.2(C) IR_R10.2
NetIR11_2: IR11.2(C) IR_R11.2
NetIR12_2: IR12.2(C) IR_R12.2
NetIR13_2: IR13.2(C) IR_R13.2
NetIR14_2: IR14.2(C) IR_R14.2
NetIR15_2: IR15.2(C) IR_R15.2
NetIR16_2: IR16.2(C) IR_R16.2
NetIR17_2: IR17.2(C) IR_R17.2
NetIR18_2: IR18.2(C) IR_R18.2
NetIR19_2: IR19.2(C) IR_R19.2
NetIR20_2: IR20.2(C) IR_R20.2
NetIR21_2: IR21.2(C) IR_R21.2
NetIR22_2: IR22.2(C) IR_R22.2
NetIR23_2: IR23.2(C) IR_R23.2
NetIR24_2: IR24.2(C) IR_R24.2
NetIR25_2: IR25.2(C) IR_R25.2
NetIR26_2: IR26.2(C) IR_R26.2
NetIR27_2: IR27.2(C) IR_R27.2
NetIR28_2: IR28.2(C) IR_R28.2
NetIR29_2: IR29.2(C) IR_R29.2
NetIR30_2: IR30.2(C) IR_R30.2
NetIR31_2: IR31.2(C) IR_R31.2
NetIR32_2: IR32.2(C) IR_R32.2
NetIR33_2: IR33.2(C) IR_R33.2
NetIR34_2: IR34.2(C) IR_R34.2
NetIR35_2: IR35.2(C) IR_R35.2
NetIR36_2: IR36.2(C) IR_R36.2
NetIR37_2: IR37.2(C) IR_R37.2
NetIR38_2: IR38.2(C) IR_R38.2
NetIR39_2: IR39.2(C) IR_R39.2
NetIR40_2: IR40.2(C) IR_R40.2
NetIR41_2: IR41.2(C) IR_R41.2
NetIR42_2: IR42.2(C) IR_R42.2
NetIR43_2: IR43.2(C) IR_R43.2
NetIR44_2: IR44.2(C) IR_R44.2
NetIR45_2: IR45.2(C) IR_R45.2
NetIR46_2: IR46.2(C) IR_R46.2
NetIR47_2: IR47.2(C) IR_R47.2
NetIR48_2: IR48.2(C) IR_R48.2
NetIR49_2: IR49.2(C) IR_R49.2
NetIR50_2: IR50.2(C) IR_R50.2
NetIR51_2: IR51.2(C) IR_R51.2
NetIR52_2: IR52.2(C) IR_R52.2
NetIR53_2: IR53.2(C) IR_R53.2
NetIR54_2: IR54.2(C) IR_R54.2
NetIR55_2: IR55.2(C) IR_R55.2
NetIR56_2: IR56.2(C) IR_R56.2
NetIR57_2: IR57.2(C) IR_R57.2
NetIR58_2: IR58.2(C) IR_R58.2
NetIR59_2: IR59.2(C) IR_R59.2
NetIR60_2: IR60.2(C) IR_R60.2
NetIR61_2: IR61.2(C) IR_R61.2
NetIR62_2: IR62.2(C) IR_R62.2
NetIR63_2: IR63.2(C) IR_R63.2
NetIR64_2: IR64.2(C) IR_R64.2
NetLED1_CKO: LED1.CKO LED2.CKI
NetLED1_SDO: LED1.SDO LED2.SDI
NetLED2_CKO: LED2.CKO LED3.CKI
NetLED2_SDO: LED2.SDO LED3.SDI
NetLED3_CKO: LED3.CKO LED4.CKI
NetLED3_SDO: LED3.SDO LED4.SDI
NetLED4_CKO: LED4.CKO LED5.CKI
NetLED4_SDO: LED4.SDO LED5.SDI
NetLED5_CKO: LED5.CKO LED6.CKI
NetLED5_SDO: LED5.SDO LED6.SDI
NetLED6_CKO: LED6.CKO LED7.CKI
NetLED6_SDO: LED6.SDO LED7.SDI
NetLED7_CKO: LED7.CKO LED8.CKI
NetLED7_SDO: LED7.SDO LED8.SDI
NetLED8_CKO: LED8.CKO LED16.CKI
NetLED8_SDO: LED8.SDO LED16.SDI
NetLED9_CKI: LED9.CKI LED10.CKO
NetLED9_CKO: LED9.CKO LED17.CKI
NetLED9_SDI: LED9.SDI LED10.SDO
NetLED9_SDO: LED9.SDO LED17.SDI
NetLED10_CKI: LED10.CKI LED11.CKO
NetLED10_SDI: LED10.SDI LED11.SDO
NetLED11_CKI: LED11.CKI LED12.CKO
NetLED11_SDI: LED11.SDI LED12.SDO
NetLED12_CKI: LED12.CKI LED13.CKO
NetLED12_SDI: LED12.SDI LED13.SDO
NetLED13_CKI: LED13.CKI LED14.CKO
NetLED13_SDI: LED13.SDI LED14.SDO
NetLED14_CKI: LED14.CKI LED15.CKO
NetLED14_SDI: LED14.SDI LED15.SDO
NetLED15_CKI: LED15.CKI LED16.CKO
NetLED15_SDI: LED15.SDI LED16.SDO
NetLED17_CKO: LED17.CKO LED18.CKI
NetLED17_SDO: LED17.SDO LED18.SDI
NetLED18_CKO: LED18.CKO LED19.CKI
NetLED18_SDO: LED18.SDO LED19.SDI
NetLED19_CKO: LED19.CKO LED20.CKI
NetLED19_SDO: LED19.SDO LED20.SDI
NetLED20_CKO: LED20.CKO LED21.CKI
NetLED20_SDO: LED20.SDO LED21.SDI
NetLED21_CKO: LED21.CKO LED22.CKI
NetLED21_SDO: LED21.SDO LED22.SDI
NetLED22_CKO: LED22.CKO LED23.CKI
NetLED22_SDO: LED22.SDO LED23.SDI
NetLED23_CKO: LED23.CKO LED24.CKI
NetLED23_SDO: LED23.SDO LED24.SDI
NetLED24_CKO: LED24.CKO LED32.CKI
NetLED24_SDO: LED24.SDO LED32.SDI
NetLED25_CKI: LED25.CKI LED26.CKO
NetLED25_CKO: LED25.CKO LED33.CKI
NetLED25_SDI: LED25.SDI LED26.SDO
NetLED25_SDO: LED25.SDO LED33.SDI
NetLED26_CKI: LED26.CKI LED27.CKO
NetLED26_SDI: LED26.SDI LED27.SDO
NetLED27_CKI: LED27.CKI LED28.CKO
NetLED27_SDI: LED27.SDI LED28.SDO
NetLED28_CKI: LED28.CKI LED29.CKO
NetLED28_SDI: LED28.SDI LED29.SDO
NetLED29_CKI: LED29.CKI LED30.CKO
NetLED29_SDI: LED29.SDI LED30.SDO
NetLED30_CKI: LED30.CKI LED31.CKO
NetLED30_SDI: LED30.SDI LED31.SDO
NetLED31_CKI: LED31.CKI LED32.CKO
NetLED31_SDI: LED31.SDI LED32.SDO
NetLED33_CKO: LED33.CKO LED34.CKI
NetLED33_SDO: LED33.SDO LED34.SDI
NetLED34_CKO: LED34.CKO LED35.CKI
NetLED34_SDO: LED34.SDO LED35.SDI
NetLED35_CKO: LED35.CKO LED36.CKI
NetLED35_SDO: LED35.SDO LED36.SDI
NetLED36_CKO: LED36.CKO LED37.CKI
NetLED36_SDO: LED36.SDO LED37.SDI
NetLED37_CKO: LED37.CKO LED38.CKI
NetLED37_SDO: LED37.SDO LED38.SDI
NetLED38_CKO: LED38.CKO LED39.CKI
NetLED38_SDO: LED38.SDO LED39.SDI
NetLED39_CKO: LED39.CKO LED40.CKI
NetLED39_SDO: LED39.SDO LED40.SDI
NetLED40_CKO: LED40.CKO LED48.CKI
NetLED40_SDO: LED40.SDO LED48.SDI
NetLED41_CKI: LED41.CKI LED42.CKO
NetLED41_CKO: LED41.CKO LED49.CKI
NetLED41_SDI: LED41.SDI LED42.SDO
NetLED41_SDO: LED41.SDO LED49.SDI
NetLED42_CKI: LED42.CKI LED43.CKO
NetLED42_SDI: LED42.SDI LED43.SDO
NetLED43_CKI: LED43.CKI LED44.CKO
NetLED43_SDI: LED43.SDI LED44.SDO
NetLED44_CKI: LED44.CKI LED45.CKO
NetLED44_SDI: LED44.SDI LED45.SDO
NetLED45_CKI: LED45.CKI LED46.CKO
NetLED45_SDI: LED45.SDI LED46.SDO
NetLED46_CKI: LED46.CKI LED47.CKO
NetLED46_SDI: LED46.SDI LED47.SDO
NetLED47_CKI: LED47.CKI LED48.CKO
NetLED47_SDI: LED47.SDI LED48.SDO
NetLED49_CKO: LED49.CKO LED50.CKI
NetLED49_SDO: LED49.SDO LED50.SDI
NetLED50_CKO: LED50.CKO LED51.CKI
NetLED50_SDO: LED50.SDO LED51.SDI
NetLED51_CKO: LED51.CKO LED52.CKI
NetLED51_SDO: LED51.SDO LED52.SDI
NetLED52_CKO: LED52.CKO LED53.CKI
NetLED52_SDO: LED52.SDO LED53.SDI
NetLED53_CKO: LED53.CKO LED54.CKI
NetLED53_SDO: LED53.SDO LED54.SDI
NetLED54_CKO: LED54.CKO LED55.CKI
NetLED54_SDO: LED54.SDO LED55.SDI
NetLED55_CKO: LED55.CKO LED56.CKI
NetLED55_SDO: LED55.SDO LED56.SDI
NetLED56_CKO: LED56.CKO LED64.CKI
NetLED56_SDO: LED56.SDO LED64.SDI
NetLED57_CKI: LED57.CKI LED58.CKO
NetLED57_CKO: LED57.CKO ROUT0.2
NetLED57_SDI: LED57.SDI LED58.SDO
NetLED57_SDO: LED57.SDO ROUT1.2
NetLED58_CKI: LED58.CKI LED59.CKO
NetLED58_SDI: LED58.SDI LED59.SDO
NetLED59_CKI: LED59.CKI LED60.CKO
NetLED59_SDI: LED59.SDI LED60.SDO
NetLED60_CKI: LED60.CKI LED61.CKO
NetLED60_SDI: LED60.SDI LED61.SDO
NetLED61_CKI: LED61.CKI LED62.CKO
NetLED61_SDI: LED61.SDI LED62.SDO
NetLED62_CKI: LED62.CKI LED63.CKO
NetLED62_SDI: LED62.SDI LED63.SDO
NetLED63_CKI: LED63.CKI LED64.CKO
NetLED63_SDI: LED63.SDI LED64.SDO
NetM_C_1: M_C.1(Y4) Rci4.1 ; port csel4
NetM_C_2: M_C.2(Y6) Rci6.1 ; port csel6
NetM_C_4: M_C.4(Y7) Rci7.1 ; port csel7
NetM_C_5: M_C.5(Y5) Rci5.1 ; port csel5
NetM_C_12: M_C.12(Y3) Rci3.1 ; port csel3
NetM_C_13: M_C.13(Y0) Rci0.1 ; port csel0
NetM_C_14: M_C.14(Y1) Rci1.1 ; port csel1
NetM_C_15: M_C.15(Y2) Rci2.1 ; port csel2
NetM_R_1: M_R.1(Y4) Rin5.2 ; port rsel5
NetM_R_2: M_R.2(Y6) Rin6.2 ; port rsel6
NetM_R_4: M_R.4(Y7) Rin7.2 ; port rsel7
NetM_R_5: M_R.5(Y5) Rin4.2 ; port rsel4
NetM_R_12: M_R.12(Y3) Rin3.2 ; port rsel3
NetM_R_13: M_R.13(Y0) Rin0.2 ; port rsel0
NetM_R_14: M_R.14(Y1) Rin1.2 ; port rsel1
NetM_R_15: M_R.15(Y2) Rin2.2 ; port rsel2
NetMOSN0_1: MOSN0.1(G) Rcg0.1 Rci0.2
NetMOSN1_1: MOSN1.1(G) Rcg1.1 Rci1.2
NetMOSN2_1: MOSN2.1(G) Rcg2.1 Rci2.2
NetMOSN3_1: MOSN3.1(G) Rcg3.1 Rci3.2
NetMOSN4_1: MOSN4.1(G) Rcg4.1 Rci4.2
NetMOSN5_1: MOSN5.1(G) Rcg5.1 Rci5.2
NetMOSN6_1: MOSN6.1(G) Rcg6.1 Rci6.2
NetMOSN7_1: MOSN7.1(G) Rcg7.1 Rci7.2
NetMOSP0_1: MOSP0.1(G) Rin0.1 Rvs0.2
NetMOSP1_1: MOSP1.1(G) Rin1.1 Rvs1.2
NetMOSP2_1: MOSP2.1(G) Rin2.1 Rvs2.2
NetMOSP3_1: MOSP3.1(G) Rin3.1 Rvs3.2
NetMOSP4_1: MOSP4.1(G) Rin4.1 Rvs4.2
NetMOSP5_1: MOSP5.1(G) Rin5.1 Rvs5.2
NetMOSP6_1: MOSP6.1(G) Rin6.1 Rvs6.2
NetMOSP7_1: MOSP7.1(G) Rin7.1 Rvs7.2

Not connected (* = marked no-connect by the designer): H1 3(5V) 4(B9) 5(B8) 8(B5) 9(B4) 14(A10) 21 22 23 24 25 26 27 28 29 30 31 32 33 34 35 36 37 38 39 40; H2 1 2 3 4 5 6 7 8 9 10 11 12 13 14 15 16 17 18 19 20 21(VB) 22(C13) 23(C14) 24(C15) 33(B0) 34(B1) 37(R); M_C 3(Z); M_R 3(Z)

### Library data of the parts
319_0-319_3 = 319_4: pad for mill max 319 series
810_0-810_3 = 810_4: pad for mill max 810 series
C1-C4 = Cap Semi: Capacitor (Semiconductor SIM Model); Published: 8-Jun-2000; LatestRevisionDate: 29-May-2009; LatestRevisionNote: IPC-7351 Footprint Added.; PackageReference: C1206; Publisher: Altium Limited; PackageDescription: Chip Capacitor
H1 H2 = NPTC202KFMS-RC: 40 Position Header Connector 0.100" (2.54mm) Surface Mount Tin
H_3_1 = 3POSHEADER: 3 POS HEADER
IR1-IR64 = IR26-51C: IR26-51C SMD IR Emitter
IR_R1-IR_R64 = Res3: IR Emitter Resistor; Published: 8-Jun-2000; LatestRevisionDate: 29-May-2009; LatestRevisionNote: IPC-7351 Footprint Added.; PackageReference: J1-0603; Publisher: Altium Limited; PackageDescription: Chip Resistor
LED1-LED64 = COM-14608: Manufacturer_Name: SparkFun; Manufacturer_Part_Number: COM-14608; Mouser_Part_Number: 474-COM-14608; Mouser_Price-Stock: https://www.mouser.com/Search/Refine.aspx?Keyword=474-COM-14608; Height: 1mm
M_C M_R = 74HC4051PW,118: Manufacturer_Name: Nexperia; Manufacturer_Part_Number: 74HC4051PW,118; RS_Part_Number: 1707982; RS_Price-Stock: http://uk.rs-online.com/web/p/products/1707982; Mouser_Part_Number: 771-74HC4051PW-T; Mouser_Price-Stock: https://www.mouser.com/Search/Refine.aspx?Keyword=771-74HC4051PW-T; Height: mm
MOSN0-MOSN7 = DMN1019USN-7: Manufacturer_Name: Diodes Inc.; Manufacturer_Part_Number: DMN1019USN-7; RS_Part_Number: 1658326; RS_Price-Stock: http://uk.rs-online.com/web/p/products/1658326; Mouser_Part_Number: 621-DMN1019USN-7; Mouser_Price-Stock: https://www.mouser.com/Search/Refine.aspx?Keyword=621-DMN1019USN-7; Height: 1.3mm
MOSP0-MOSP7 = NTS2101PT1G: Manufacturer_Name: ON Semiconductor; Allied_Number: 70341398; Manufacturer_Part_Number: NTS2101PT1G; RS_Part_Number: 1631139; RS_Price-Stock: http://uk.rs-online.com/web/p/products/1631139; Allied_Price-Stock: http://www.alliedelec.com/on-semiconductor-nts2101pt1g/70341398/; Mouser_Part_Number: 863-NTS2101PT1G; Mouser_Price-Stock: https://www.mouser.com/Search/Refine.aspx?Keyword=863-NTS2101PT1G; Height: 1mm
PT_R1-PT_R64 = Res3: Phototransitor Resistor; Published: 8-Jun-2000; LatestRevisionDate: 29-May-2009; LatestRevisionNote: IPC-7351 Footprint Added.; PackageReference: J1-0603; Publisher: Altium Limited; PackageDescription: Chip Resistor
R200 R201 ROUT0 ROUT1 = Res3: Resistor; Published: 8-Jun-2000; LatestRevisionDate: 29-May-2009; LatestRevisionNote: IPC-7351 Footprint Added.; PackageReference: J1-0603; Publisher: Altium Limited; PackageDescription: Chip Resistor
Rcg0-Rcg7 = Res3: Rcg Resistor; Published: 8-Jun-2000; LatestRevisionDate: 29-May-2009; LatestRevisionNote: IPC-7351 Footprint Added.; PackageReference: J1-0603; Publisher: Altium Limited; PackageDescription: Chip Resistor
Rci0-Rci7 = Res3: Csel Resistor; Published: 8-Jun-2000; LatestRevisionDate: 29-May-2009; LatestRevisionNote: IPC-7351 Footprint Added.; PackageReference: J1-0603; Publisher: Altium Limited; PackageDescription: Chip Resistor
Rin0-Rin7 = Res3: Rsel resistor; Published: 8-Jun-2000; LatestRevisionDate: 29-May-2009; LatestRevisionNote: IPC-7351 Footprint Added.; PackageReference: J1-0603; Publisher: Altium Limited; PackageDescription: Chip Resistor
Rvs0-Rvs7 = Res3: Rvs Resistor; Published: 8-Jun-2000; LatestRevisionDate: 29-May-2009; LatestRevisionNote: IPC-7351 Footprint Added.; PackageReference: J1-0603; Publisher: Altium Limited; PackageDescription: Chip Resistor